# EAGLE design SOT23-3 (EAGLE 7.3.0)
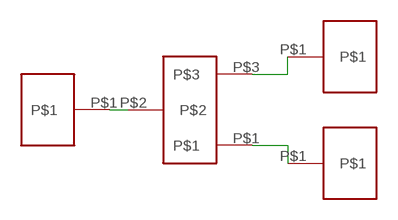
[diagram p0: schematic, sheet 1]

## Parts
U$1  SOT23-3  [SOT23-3]
U$2  PAD  [100MIL_PAD]
U$3  PAD  [100MIL_PAD]
U$4  PAD  [100MIL_PAD]

## Nets
N$1: U$1.P$2 U$2.P$1
N$2: U$1.P$3 U$3.P$1
N$3: U$1.P$1 U$4.P$1

## Library data of the parts
U$1 = generic_smd:SOT23-3
U$2-U$4 = generic_smd:PAD

## Board
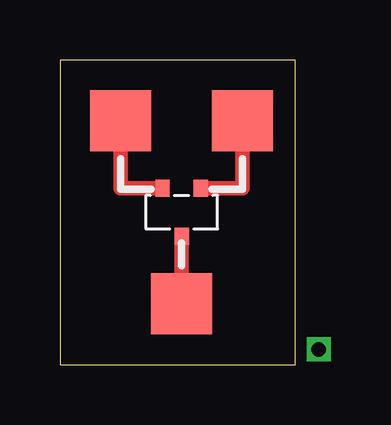
[diagram p1: board, top side]
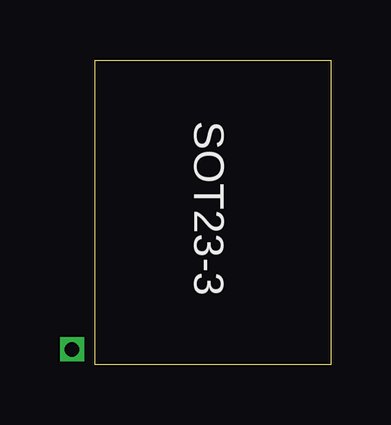
[diagram p2: board, bottom side, seen from below]

Size 9.83 x 12.69 mm. Coordinates in mm from the lower left corner, seen from the top.
Outline: 0,0 9.83,0 9.83,12.69 0,12.69 0,0
Copper layers (1*16): Top 0.035mm / dielectric 1.5mm / Bottom 0.035mm
Design rules "default": minimum track width 10mil, minimum drill 24mil, track to track 8mil, track to pad 8mil, pad to pad 8mil, via to via 8mil, smd to smd 8mil, copper to edge 40mil, drill to drill 8mil, minimum pad ring 10mil, minimum via ring 8mil, stop-mask expansion 4mil, vias tented up to drill 0mil, thermal gap 10mil

### Footprints (pad centres in the part's own frame; a part is rotated, then mirrored left to right if it is on the bottom)
SOT23-3 = smd 0.6 x 0.7: P$1 0.8,1; P$2 0,-1; P$3 -0.8,1
100MIL_PAD = smd 2.54 x 2.54: P$1 0,0

### Placement (x,y rotation side)
U$1  5.08,6.35 0 top
U$2  5.08,2.54 0 top
U$3  2.54,10.16 0 top
U$4  7.62,10.16 0 top

### Tracks (layer width: path | path; a pad name or v marks a point on that pad's centre or on a via)
N$1
  Top 0.61: U$1.P$2 U$2.P$1
N$2
  Top 0.61: U$1.P$3 2.54,7.35 U$3.P$1
N$3
  Top 0.61: U$1.P$1 7.62,7.35 U$4.P$1
N$4  (via drill 0.6)
  other vias: 10.79,0.64

### Text on the board
bPlace: SOT23-3
Document: via required to force drill file generation